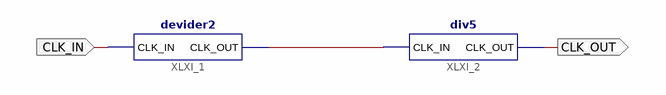
[diagram p0: schematic sheet 1]
// Xilinx ISE schematic div10.sch (spartan6) as structural Verilog: 2 symbols, 2 ports
module div10 (
  input  CLK_IN,
  output CLK_OUT
);

  wire XLXN_2;

  devider2 XLXI_1 (.CLK_IN(CLK_IN), .CLK_OUT(XLXN_2));
  div5 XLXI_2 (.CLK_IN(XLXN_2), .CLK_OUT(CLK_OUT));
endmodule
